# EAGLE design plyta_glowna0.1 (EAGLE 7.5.0)
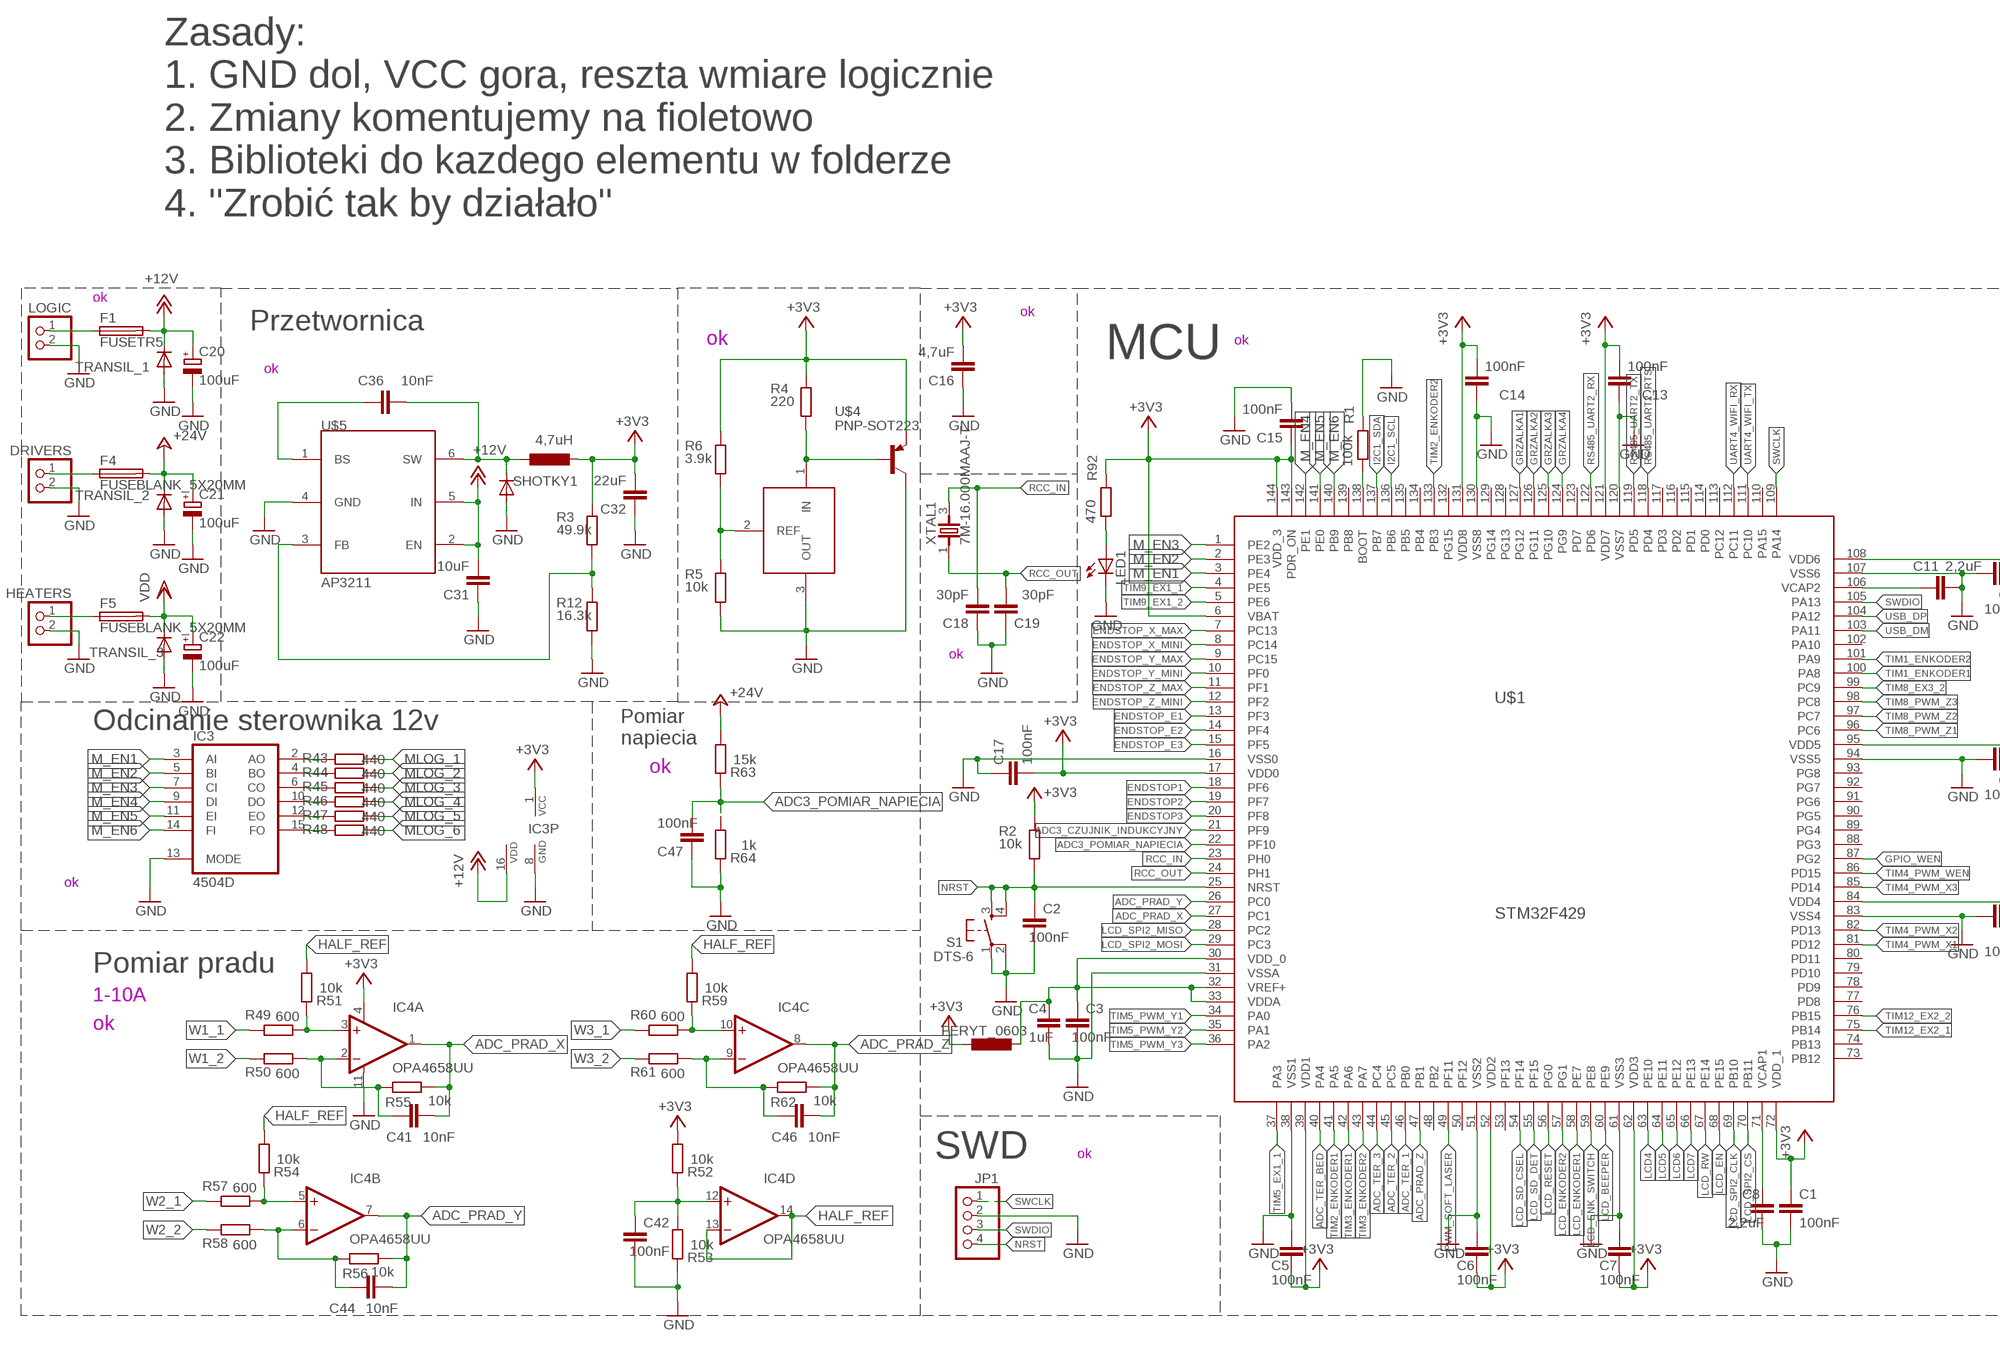
[diagram p0: schematic, sheet 1, part 1 of 2]
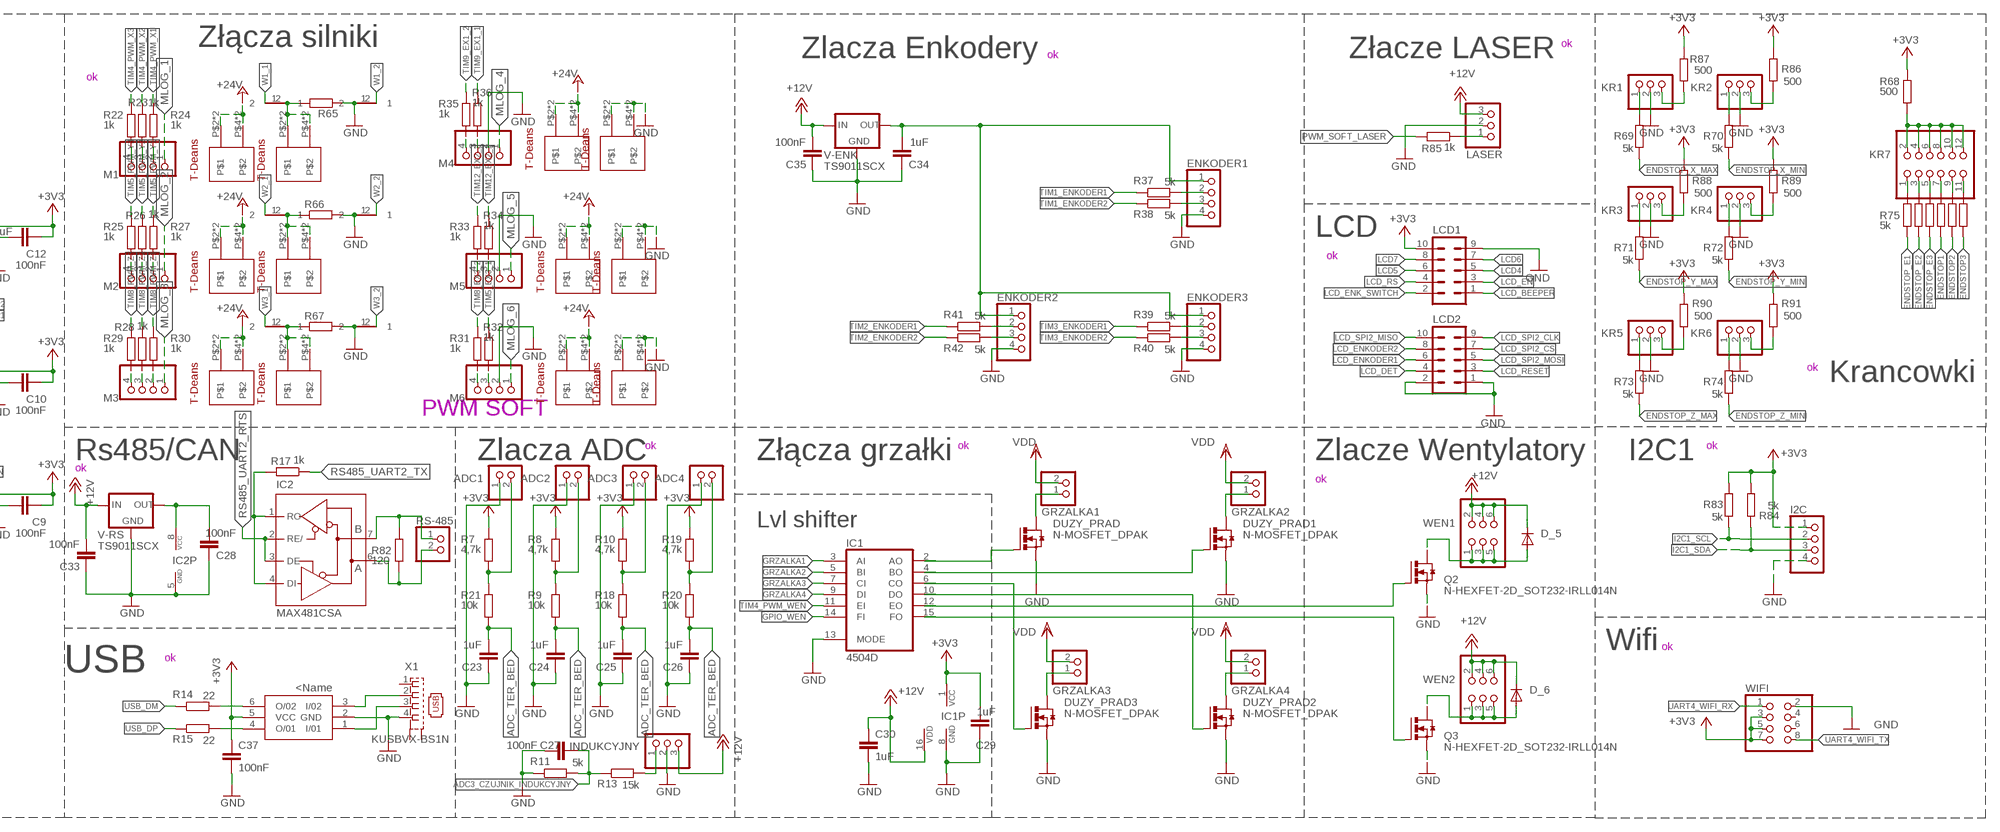
[diagram p1: schematic, sheet 1, part 2 of 2]

## Parts
1  PLYTKA_T  [PLYTKA_T]
2  PLYTKA_T  [PLYTKA_T]
3  PLYTKA_T  [PLYTKA_T]
4  PLYTKA_T  [PLYTKA_T]
4,7UH  FERYT_0603  [R0603]
5  PLYTKA_T  [PLYTKA_T]
6  PLYTKA_T  [PLYTKA_T]
7  PLYTKA_T  [PLYTKA_T]
8  PLYTKA_T  [PLYTKA_T]
9  PLYTKA_T  [PLYTKA_T]
10  PLYTKA_T  [PLYTKA_T]
11  PLYTKA_T  [PLYTKA_T]
12  PLYTKA_T  [PLYTKA_T]
ADC1  PINHD-1X2  [1X02]
ADC2  PINHD-1X2  [1X02]
ADC3  PINHD-1X2  [1X02]
ADC4  PINHD-1X2  [1X02]
C1  100nF  C-EUC0603  [C0603]
C2  100nF  C-EUC0603  [C0603]
C3  100nF  C-EUC0603  [C0603]
C4  1uF  C-EUC0603  [C0603]
C5  100nF  C-EUC0603  [C0603]
C6  100nF  C-EUC0603  [C0603]
C7  100nF  C-EUC0603  [C0603]
C8  2,2uF  C-EUC0603  [C0603]
C9  100nF  C-EUC0603  [C0603]
C10  100nF  C-EUC0603  [C0603]
C11  2,2uF  C-EUC0603  [C0603]
C12  100nF  C-EUC0603  [C0603]
C13  100nF  C-EUC0603  [C0603]
C14  100nF  C-EUC0603  [C0603]
C15  100nF  C-EUC0603  [C0603]
C16  4,7uF  C-EUC0603  [C0603]
C17  100nF  C-EUC0603  [C0603]
C18  30pF  C-EUC0603  [C0603]
C19  30pF  C-EUC0603  [C0603]
C20  100uF  CPOL-EUUD-8X10  [UD-8X10_NICHICON]
C21  100uF  CPOL-EUUD-8X10  [UD-8X10_NICHICON]
C22  100uF  CPOL-EUUD-8X10  [UD-8X10_NICHICON]
C23  1uF  C-EUC0603  [C0603]
C24  1uF  C-EUC0603  [C0603]
C25  1uF  C-EUC0603  [C0603]
C26  1uF  C-EUC0603  [C0603]
C27  100nF  C-EUC0603  [C0603]
C28  100nF  C-EUC0603  [C0603]
C29  1uF  C-EUC0603  [C0603]
C30  1uF  C-EUC0603  [C0603]
C31  10uF  C-EUC0603  [C0603]
C32  22uF  C-EUC0603  [C0603]
C33  100nF  C-EUC0603  [C0603]
C34  1uF  C-EUC0603  [C0603]
C35  100nF  C-EUC0603  [C0603]
C36  10nF  C-EUC0603  [C0603]
C37  100nF  C-EUC0603  [C0603]
C41  10nF  C-EUC0603  [C0603]
C42  100nF  C-EUC0603  [C0603]
C44  10nF  C-EUC0603  [C0603]
C46  10nF  C-EUC0603  [C0603]
C47  100nF  C-EUC0603  [C0603]
D_5  DIODE-DO-214AC  [DO-214AC]
D_6  DIODE-DO-214AC  [DO-214AC]
DRIVERS  PINHD-1X2  [1X02]
DUZY_PRAD  N-MOSFET_DPAK  [D-PAK_TO252AA]
DUZY_PRAD1  N-MOSFET_DPAK  [D-PAK_TO252AA]
DUZY_PRAD2  N-MOSFET_DPAK  [D-PAK_TO252AA]
DUZY_PRAD3  N-MOSFET_DPAK  [D-PAK_TO252AA]
ENKODER1  PINHD-1X4  [1X04]
ENKODER2  PINHD-1X4  [1X04]
ENKODER3  PINHD-1X4  [1X04]
F1  FUSETR5  [TR5]
F4  FUSEBLANK_5X20MM  [FUSE_HOLDER_5X20MM]
F5  FUSEBLANK_5X20MM  [FUSE_HOLDER_5X20MM]
GRZALKA1  PINHD-1X2  [1X02]
GRZALKA2  PINHD-1X2  [1X02]
GRZALKA3  PINHD-1X2  [1X02]
GRZALKA4  PINHD-1X2  [1X02]
HEATERS  PINHD-1X2  [1X02]
I2C  PINHD-1X4  [1X04]
IC1  4504D  [SO16]
IC2  MAX481CSA  [SO08]
IC3  4504D  [SO16]
IC4  OPA4658UU  [SO14]
INDUKCYJNY  PINHD-1X3  [1X03]
JP1  PINHD-1X4  [1X04]
KR1  PINHD-1X3  [1X03]
KR2  PINHD-1X3  [1X03]
KR3  PINHD-1X3  [1X03]
KR4  PINHD-1X3  [1X03]
KR5  PINHD-1X3  [1X03]
KR6  PINHD-1X3  [1X03]
KR7  PINHD-2X6  [2X06]
LASER  PINHD-1X3  [1X03]
LCD1  ML10  [ML10]
LCD2  ML10  [ML10]
LED1  LEDSML0603  [SML0603]
LOGIC  PINHD-1X2  [1X02]
M1  PINHD-1X4  [1X04]
M2  PINHD-1X4  [1X04]
M3  PINHD-1X4  [1X04]
M4  PINHD-1X4  [1X04]
M5  PINHD-1X4  [1X04]
M6  PINHD-1X4  [1X04]
Q2  N-HEXFET-2D_SOT232-IRLL014N  [SOT223]
Q3  N-HEXFET-2D_SOT232-IRLL014N  [SOT223]
R1  100k  R-EU_R0603  [R0603]
R2  10k  R-EU_R0603  [R0603]
R3  49.9k  R-EU_R0603  [R0603]
R4  220  R-EU_R0603  [R0603]
R5  10k  R-EU_R0603  [R0603]
R6  3.9k  R-EU_R0603  [R0603]
R7  4,7k  R-EU_R0603  [R0603]
R8  4,7k  R-EU_R0603  [R0603]
R9  10k  R-EU_R0603  [R0603]
R10  4,7k  R-EU_R0603  [R0603]
R11  5k  R-EU_R0603  [R0603]
R12  16.3k  R-EU_R0603  [R0603]
R13  15k  R-EU_R0603  [R0603]
R14  22  R-EU_R0603  [R0603]
R15  22  R-EU_R0603  [R0603]
R17  1k  R-EU_R0603  [R0603]
R18  10k  R-EU_R0603  [R0603]
R19  4,7k  R-EU_R0603  [R0603]
R20  10k  R-EU_R0603  [R0603]
R21  10k  R-EU_R0603  [R0603]
R22  1k  R-EU_R0603  [R0603]
R23  1k  R-EU_R0603  [R0603]
R24  1k  R-EU_R0603  [R0603]
R25  1k  R-EU_R0603  [R0603]
R26  1k  R-EU_R0603  [R0603]
R27  1k  R-EU_R0603  [R0603]
R28  1k  R-EU_R0603  [R0603]
R29  1k  R-EU_R0603  [R0603]
R30  1k  R-EU_R0603  [R0603]
R31  1k  R-EU_R0603  [R0603]
R32  1k  R-EU_R0603  [R0603]
R33  1k  R-EU_R0603  [R0603]
R34  1k  R-EU_R0603  [R0603]
R35  1k  R-EU_R0603  [R0603]
R36  1k  R-EU_R0603  [R0603]
R37  5k  R-EU_R0603  [R0603]
R38  5k  R-EU_R0603  [R0603]
R39  5k  R-EU_R0603  [R0603]
R40  5k  R-EU_R0603  [R0603]
R41  5k  R-EU_R0603  [R0603]
R42  5k  R-EU_R0603  [R0603]
R43  440  R-EU_R0603  [R0603]
R44  440  R-EU_R0603  [R0603]
R45  440  R-EU_R0603  [R0603]
R46  440  R-EU_R0603  [R0603]
R47  440  R-EU_R0603  [R0603]
R48  440  R-EU_R0603  [R0603]
R49  600  R-EU_R0603  [R0603]
R50  600  R-EU_R0603  [R0603]
R51  10k  R-EU_R0603  [R0603]
R52  10k  R-EU_R0603  [R0603]
R53  10k  R-EU_R0603  [R0603]
R54  10k  R-EU_R0603  [R0603]
R55  10k  R-EU_R0603  [R0603]
R56  10k  R-EU_R0603  [R0603]
R57  600  R-EU_R0603  [R0603]
R58  600  R-EU_R0603  [R0603]
R59  10k  R-EU_R0603  [R0603]
R60  600  R-EU_R0603  [R0603]
R61  600  R-EU_R0603  [R0603]
R62  10k  R-EU_R0603  [R0603]
R63  15k  R-EU_R0603  [R0603]
R64  1k  R-EU_R0603  [R0603]
R65  R-EU_R2512  [R2512]
R66  R-EU_R2512  [R2512]
R67  R-EU_R2512  [R2512]
R68  500  R-EU_R0603  [R0603]
R69  5k  R-EU_R0603  [R0603]
R70  5k  R-EU_R0603  [R0603]
R71  5k  R-EU_R0603  [R0603]
R72  5k  R-EU_R0603  [R0603]
R73  5k  R-EU_R0603  [R0603]
R74  5k  R-EU_R0603  [R0603]
R75  5k  R-EU_R0603  [R0603]
R76  5k  R-EU_R0603  [R0603]
R77  5k  R-EU_R0603  [R0603]
R78  5k  R-EU_R0603  [R0603]
R79  5k  R-EU_R0603  [R0603]
R80  5k  R-EU_R0603  [R0603]
R82  120  R-EU_R0603  [R0603]
R83  5k  R-EU_R0603  [R0603]
R84  5k  R-EU_R0603  [R0603]
R85  1k  R-EU_R0603  [R0603]
R86  500  R-EU_R0603  [R0603]
R87  500  R-EU_R0603  [R0603]
R88  500  R-EU_R0603  [R0603]
R89  500  R-EU_R0603  [R0603]
R90  500  R-EU_R0603  [R0603]
R91  500  R-EU_R0603  [R0603]
R92  470  R-EU_R0603  [R0603]
RS-485  PINHD-1X2  [1X02]
S1  DTS-6  [DTS-6]
SHOTKY1  DIODE-DO-214AC  [DO-214AC]
TRANSIL_1  DIODE-DO-214AC  [DO-214AC]
TRANSIL_2  DIODE-DO-214AC  [DO-214AC]
TRANSIL_3  DIODE-DO-214AC  [DO-214AC]
U$1  STM32F429  [SQFP-S-20X20-144]
U$2  FERYT_0603  [R0603]
U$3  TL431AIDBZR  [SOT23]
U$4  PNP-SOT223  [SOT223]
U$5  AP3211  [TSOT23]
U$6  USBLC6-2  [SOT95P275X110-6N]
U$20  SEPARATOR  [SEPARATOR]
U$21  SEPARATOR  [SEPARATOR]
U$22  SEPARATOR  [SEPARATOR]
U$23  SEPARATOR  [SEPARATOR]
U$24  SEPARATOR  [SEPARATOR]
U$25  SEPARATOR  [SEPARATOR]
V-ENK  TS9011SCX  [SOT23]
V-RS  TS9011SCX  [SOT23]
WEN1  PINHD-2X3  [2X03]
WEN2  PINHD-2X3  [2X03]
WIFI  PINHD-2X4  [2X04]
X1  KUSBVX-BS1N  [KUSBVX-BS1N]
XTAL1  7M-16.000MAAJ-T  [TXC_7M-16.000MAAJ-T]

## Nets
+3V3: 4,7UH.2 C1.1 C5.2 C6.2 C7.2 C9.2 C10.2 C12.2 C13.2 C14.2 C15.1 C16.2 C17.2 C29.2 C32.2 C37.1 I2C.1 IC1.1(VCC) IC3.1(VCC) IC4.4(A:V+) LCD1.10 R2.1 R3.1 R4.1 R6.1 R7.1 R8.1 R10.1 R19.1 R52.2 R68.2 R83.2 R84.2 R86.1 R87.1 R88.1 R89.1 R90.1 R91.1 R92.1 U$1.6(VBAT) U$1.17(VDD0) U$1.39(VDD1) U$1.52(VDD2) U$1.62(VDD3) U$1.72(VDD_1) U$1.84(VDD4) U$1.95(VDD5) U$1.108(VDD6) U$1.121(VDD7) U$1.131(VDD8) U$1.143(PDR_ON) U$1.144(VDD_3) U$2.1 U$4.3(E) U$6.5(VCC) WIFI.3 WIFI.5 WIFI.7
+12V: C20.+ C30.1 C31.2 C33.2 C35.2 D_5.C D_6.C F1.2 IC1.16(VDD) IC3.16(VDD) INDUKCYJNY.3 LASER.3 TRANSIL_1.C U$5.2(EN) U$5.5(IN) V-ENK.3(IN) V-RS.3(IN) WEN1.2 WEN1.4 WEN1.6 WEN2.2 WEN2.4 WEN2.6
+24V: 1.P$2 1.P$3 1.P$4 1.P$5 3.P$2 3.P$3 3.P$4 3.P$5 5.P$2 5.P$3 5.P$4 5.P$5 7.P$2 7.P$3 7.P$4 7.P$5 9.P$2 9.P$3 9.P$4 9.P$5 11.P$2 11.P$3 11.P$4 11.P$5 C21.+ F4.2 R63.2 TRANSIL_2.C
ADC3_CZUJNIK_INDUKCYJNY: U$1.21(PF9)
ADC3_POMIAR_NAPIECIA: C47.2 R63.1 R64.2 U$1.22(PF10)
ADC_PRAD_X: C41.2 IC4.1(A:OUT) R55.1 U$1.27(PC1)
ADC_PRAD_Y: C44.2 IC4.7(B:OUT) R56.1 U$1.26(PC0)
ADC_PRAD_Z: C46.2 IC4.8(C:OUT) R62.1 U$1.47(PB1)
ADC_TER_1: U$1.46(PB0)
ADC_TER_2: U$1.45(PC5)
ADC_TER_3: U$1.44(PC4)
ADC_TER_BED: C23.2 C24.2 C25.2 C26.2 R9.2 R18.2 R20.2 R21.2 U$1.40(PA4)
ENDSTOP1: R78.2 U$1.18(PF6)
ENDSTOP2: R79.2 U$1.19(PF7)
ENDSTOP3: R80.2 U$1.20(PF8)
ENDSTOP_E1: R75.2 U$1.13(PF3)
ENDSTOP_E2: R76.2 U$1.14(PF4)
ENDSTOP_E3: R77.2 U$1.15(PF5)
ENDSTOP_X_MAX: R69.1 U$1.7(PC13)
ENDSTOP_X_MINI: R70.1 U$1.8(PC14)
ENDSTOP_Y_MAX: R71.1 U$1.9(PC15)
ENDSTOP_Y_MINI: R72.1 U$1.10(PF0)
ENDSTOP_Z_MAX: R73.1 U$1.11(PF1)
ENDSTOP_Z_MINI: R74.1 U$1.12(PF2)
GND: 8.P$2 8.P$3 8.P$4 8.P$5 10.P$2 10.P$3 10.P$4 10.P$5 12.P$2 12.P$3 12.P$4 12.P$5 ADC1.1 ADC2.1 ADC3.1 ADC4.1 C1.2 C2.2 C3.2 C4.2 C5.1 C6.1 C7.1 C8.2 C9.1 C10.1 C11.2 C12.1 C13.1 C14.1 C15.2 C16.1 C17.1 C18.1 C19.1 C20.- C21.- C22.- C23.1 C24.1 C25.1 C26.1 C27.2 C28.1 C29.1 C30.2 C31.1 C32.1 C33.1 C34.1 C35.1 C37.2 C42.2 C47.1 DRIVERS.2 DUZY_PRAD1.3(S) DUZY_PRAD2.3(S) DUZY_PRAD3.3(S) DUZY_PRAD.3(S) ENKODER1.4 ENKODER2.4 ENKODER3.4 HEATERS.2 I2C.4 IC1.8(GND) IC1.13(MODE) IC2.5(GND) IC3.8(GND) IC3.13(MODE) IC4.11(A:V-) INDUKCYJNY.2 JP1.2 KR1.2 KR2.2 KR3.2 KR4.2 KR5.2 KR6.2 LASER.2 LCD1.9 LCD2.1 LCD2.2 LED1.C LOGIC.2 M4.2 M5.2 M6.2 Q2.3(S) Q3.3(S) R1.1 R5.2 R11.1 R12.2 R53.1 R64.1 R65.1 R66.2 R67.2 S1.1 S1.2 SHOTKY1.A TRANSIL_1.A TRANSIL_2.A TRANSIL_3.A U$1.16(VSS0) U$1.31(VSSA) U$1.38(VSS1) U$1.51(VSS2) U$1.61(VSS3) U$1.83(VSS4) U$1.94(VSS5) U$1.107(VSS6) U$1.120(VSS7) U$1.130(VSS8) U$3.3(OUT) U$4.2(C) U$4.4(C) U$5.4(GND) U$6.2(GND) U$20.1 U$21.1 U$22.1 V-ENK.1(GND) V-RS.1(GND) WIFI.2 X1.4
GPIO_WEN: IC1.14(FI) U$1.87(PG2)
GRZALKA1: IC1.3(AI) U$1.127(PG12)
GRZALKA2: IC1.5(BI) U$1.126(PG11)
GRZALKA3: IC1.7(CI) U$1.125(PG10)
GRZALKA4: IC1.9(DI) U$1.124(PG9)
HALF_REF: IC4.13(D:-IN) IC4.14(D:OUT) R51.2 R54.2 R59.2
I2C1_SCL: I2C.2 R83.1 U$1.136(PB6)
I2C1_SDA: I2C.3 R84.1 U$1.137(PB7)
LCD4: LCD1.5 U$1.63(PE10)
LCD5: LCD1.6 U$1.64(PE11)
LCD6: LCD1.7 U$1.65(PE12)
LCD7: LCD1.8 U$1.66(PE13)
LCD_BEEPER: LCD1.1 U$1.60(PE9)
LCD_DET: LCD2.4
LCD_EN: LCD1.3 U$1.68(PE15)
LCD_ENK_SWITCH: LCD1.2 U$1.59(PE8)
LCD_ENKODER1: LCD2.6 U$1.58(PE7)
LCD_ENKODER2: LCD2.8 U$1.57(PG1)
LCD_RESET: LCD2.3 U$1.56(PG0)
LCD_RS: LCD1.4
LCD_RW: U$1.67(PE14)
LCD_SD_CSEL: U$1.54(PF14)
LCD_SD_DET: U$1.55(PF15)
LCD_SPI2_CLK: LCD2.9 U$1.69(PB10)
LCD_SPI2_CS: LCD2.7 U$1.70(PB11)
LCD_SPI2_MISO: LCD2.10 U$1.28(PC2)
LCD_SPI2_MOSI: LCD2.5 U$1.29(PC3)
M_EN1: IC3.3(AI)
M_EN3: U$1.1(PE2)
MLOG_1: M1.1 R43.2
MLOG_2: M2.1 R44.2
MLOG_3: M3.1 R45.2
MLOG_4: M4.1 R46.2
MLOG_5: M5.1 R47.2
MLOG_6: M6.1 R48.2
N$1: 4,7UH.1 C36.1 SHOTKY1.C U$5.6(SW)
N$2: C8.1 U$1.71(VCAP1)
N$3: R3.2 R12.1 U$5.3(FB)
N$4: R14.2 U$6.6(O/02)
N$5: C3.1 C4.1 U$1.30(VDD_0) U$1.32(VREF+) U$1.33(VDDA) U$2.2
N$6: R5.1 R6.2 U$3.2(REF)
N$7: F1.1 LOGIC.1
N$8: DRIVERS.1 F4.1
N$9: R4.2 U$3.1(IN) U$4.1(B)
N$10: F5.1 HEATERS.1
N$11: D_6.A Q3.2(D) Q3.4(D) WEN2.1 WEN2.3 WEN2.5
N$12: DUZY_PRAD.4(D) GRZALKA1.1
N$13: R15.2 U$6.4(O/01)
N$15: D_5.A Q2.2(D) Q2.4(D) WEN1.1 WEN1.3 WEN1.5
N$16: U$6.1(I/01) X1.3
N$17: DUZY_PRAD1.4(D) GRZALKA2.1
N$18: DUZY_PRAD2.4(D) GRZALKA4.1
N$19: C11.1 U$1.106(VCAP2)
N$20: DUZY_PRAD3.4(D) GRZALKA3.1
N$21: DUZY_PRAD.1(G) IC1.2(AO)
N$22: KR1.1 R69.2
N$23: LASER.1 R85.1
N$24: KR3.1 R71.2
N$25: KR2.1 R70.2
N$26: R1.2 U$1.138(BOOT)
N$27: KR4.1 R72.2
N$28: KR6.1 R74.2
N$29: KR5.1 R73.2
N$30: IC2.7(B) R82.1 RS-485.1
N$31: IC2.6(A) R82.2 RS-485.2
N$32: KR7.1 R75.1
N$33: DUZY_PRAD1.1(G) IC1.4(BO)
N$34: DUZY_PRAD3.1(G) IC1.6(CO)
N$35: DUZY_PRAD2.1(G) IC1.10(DO)
N$36: IC1.12(EO) Q2.1(G)
N$37: IC1.15(FO) Q3.1(G)
N$38: INDUKCYJNY.1 R13.2
N$39: C36.2 U$5.1(BS)
N$40: C28.2 IC2.8(VCC) V-RS.2(OUT)
N$41: M1.4 R22.2
N$42: ADC2.2 R8.2 R9.1
N$43: ADC1.2 R7.2 R21.1
N$44: ADC3.2 R10.2 R18.1
N$45: M1.3 R23.2
N$46: M1.2 R24.2
N$47: ADC4.2 R19.2 R20.1
N$48: M6.4 R31.2
N$49: M2.4 R25.2
N$50: M2.3 R26.2
N$51: M6.3 R32.2
N$52: M3.4 R29.2
N$53: M3.3 R28.2
N$54: U$6.3(I/02) X1.2
N$55: M5.4 R33.2
N$56: M5.3 R34.2
N$57: M2.2 R27.2
N$58: M4.4 R35.2
N$59: M4.3 R36.2
N$60: ENKODER1.2 R37.2
N$61: ENKODER1.3 R38.2
N$62: ENKODER3.2 R39.2
N$63: ENKODER3.3 R40.2
N$64: ENKODER2.2 R41.2
N$65: ENKODER2.3 R42.2
N$67: IC3.2(AO) R43.1
N$68: IC3.4(BO) R44.1
N$69: IC3.6(CO) R45.1
N$70: IC3.10(DO) R46.1
N$71: IC3.12(EO) R47.1
N$72: IC3.15(FO) R48.1
N$73: IC4.3(A:+IN) R49.2 R51.1
N$74: C42.1 IC4.12(D:+IN) R52.1 R53.2
N$75: C41.1 IC4.2(A:-IN) R50.2 R55.2
N$76: C46.1 IC4.9(C:-IN) R61.2 R62.2
N$77: 2.P$2 2.P$3 2.P$4 2.P$5 R65.2 U$23.2
N$78: 4.P$2 4.P$3 4.P$4 4.P$5 R66.1 U$24.2
N$79: IC4.10(C:+IN) R59.1 R60.2
N$80: C44.1 IC4.6(B:-IN) R56.2 R58.2
N$81: IC4.5(B:+IN) R54.1 R57.2
N$83: 6.P$2 6.P$3 6.P$4 6.P$5 R67.1 U$25.2
N$84: KR7.3 R76.1
N$85: KR7.5 R77.1
N$86: KR7.7 R78.1
N$87: KR7.9 R79.1
N$88: KR7.11 R80.1
N$89: KR7.2 KR7.4 KR7.6 KR7.8 KR7.10 KR7.12 R68.1
N$90: KR1.3 R87.2
N$91: KR2.3 R86.2
N$92: KR3.3 R88.2
N$93: KR4.3 R89.2
N$94: KR5.3 R90.2
N$95: KR6.3 R91.2
N$96: C27.1 R11.2 R13.1
N$97: LED1.A R92.2
N$99: C34.2 ENKODER1.1 ENKODER2.1 ENKODER3.1 V-ENK.2(OUT)
NRST: C2.1 JP1.4 R2.2 S1.3 S1.4 U$1.25(NRST)
PWM_SOFT_LASER: R85.2 U$1.49(PF11)
RCC_IN: C18.2 U$1.23(PH0) XTAL1.3
RCC_OUT: C19.2 U$1.24(PH1) XTAL1.1
RS485_UART2_RTS: IC2.2(RE/) IC2.3(DE) U$1.118(PD4)
RS485_UART2_RX: U$1.122(PD6)
RS485_UART2_TX: IC2.1(RO) IC2.4(DI) R17.1 R17.2 U$1.119(PD5)
SWCLK: JP1.1 U$1.109(PA14)
SWDIO: JP1.3 U$1.105(PA13)
TIM1_ENKODER1: R37.1 U$1.100(PA8)
TIM1_ENKODER2: R38.1 U$1.101(PA9)
TIM2_ENKODER1: R41.1 U$1.41(PA5)
TIM2_ENKODER2: R42.1 U$1.133(PB3)
TIM3_ENKODER1: R39.1 U$1.42(PA6)
TIM3_ENKODER2: R40.1 U$1.43(PA7)
TIM4_PWM_WEN: IC1.11(EI) U$1.86(PD15)
TIM4_PWM_X1: R24.1 U$1.81(PD12)
TIM4_PWM_X2: R23.1 U$1.82(PD13)
TIM4_PWM_X3: R22.1 U$1.85(PD14)
TIM5_EX1_1: U$1.37(PA3)
TIM5_EX3_1: R32.1
TIM5_PWM_Y1: R27.1 U$1.34(PA0)
TIM5_PWM_Y2: R26.1 U$1.35(PA1)
TIM5_PWM_Y3: R25.1 U$1.36(PA2)
TIM8_EX3_2: R31.1 U$1.99(PC9)
TIM8_PWM_Z1: M3.2 R30.1 R30.2 U$1.96(PC6)
TIM8_PWM_Z2: R28.1 U$1.97(PC7)
TIM8_PWM_Z3: R29.1 U$1.98(PC8)
TIM9_EX1_1: R36.1 U$1.4(PE5)
TIM9_EX1_2: R35.1 U$1.5(PE6)
TIM12_EX2_1: R34.1 U$1.75(PB14)
TIM12_EX2_2: R33.1 U$1.76(PB15)
UART4_WIFI_RX: U$1.112(PC11) WIFI.1
UART4_WIFI_TX: U$1.111(PC10) WIFI.8
USB_DM: R14.1 U$1.103(PA11)
USB_DP: R15.1 U$1.104(PA12)
VDD: C22.+ F5.2 GRZALKA1.2 GRZALKA2.2 GRZALKA3.2 GRZALKA4.2 TRANSIL_3.C
W1_1: R49.1 U$23.1
W1_2: R50.1 U$20.2
W2_1: R57.1 U$24.1
W2_2: R58.1 U$21.2
W3_1: R60.1 U$25.1
W3_2: R61.1 U$22.2
Unconnected: IC3.5(BI) IC3.7(CI) IC3.9(DI) IC3.11(EI) IC3.14(FI) U$1.2(PE3) U$1.3(PE4) U$1.48(PB2) U$1.50(PF12) U$1.53(PF13) U$1.73(PB12) U$1.74(PB13) U$1.77(PD8) U$1.78(PD9) U$1.79(PD10) U$1.80(PD11) U$1.88(PG3) U$1.89(PG4) U$1.90(PG5) U$1.91(PG6) U$1.92(PG7) U$1.93(PG8) U$1.102(PA10) U$1.110(PA15) U$1.113(PC12) U$1.114(PD0) U$1.115(PD1) U$1.116(PD2) U$1.117(PD3) U$1.123(PD7) U$1.128(PG13) U$1.129(PG14) U$1.132(PG15) U$1.134(PB4) U$1.135(PB5) U$1.139(PB8) U$1.140(PB9) U$1.141(PE0) U$1.142(PE1) WIFI.4 WIFI.6 X1.1 X1.M1(S1) X1.M2(S2)

## Notes on the sheet
- Zasady:
  1. GND dol, VCC gora, reszta wmiare logicznie
  2. Zmiany komentujemy na fioletowo
  3. Biblioteki do kazdego elementu w folderze
  4. "Zrobić tak by działało"
- ok
- ok
- Przetwornica | Złącza silniki | ok
- ok | ok | Zlacza Enkodery | ok | Złacze LASER
- MCU
- ok | ok
- 4,7uH
- LCD
- ok
- ok
- Odcinanie sterownika 12v
- Pomiar
  napiecia
- ok
- Krancowki
- ok
- PWM SOFT
- ok | ok | ok
- Rs485/CAN | Zlacza ADC | Złącza grzałki | Zlacze Wentylatory | I2C1
- ok
- ok | ok
- Lvl shifter
- Pomiar pradu
- 1-10A
- ok
- Wifi | ok
- ok
- USB
- SWD | ok

## Library data of the parts
1-12 = Conector_T-deans:PLYTKA_T
4,7UH U$2 = rcl:FERYT_0603
ADC1-ADC4 DRIVERS GRZALKA1-GRZALKA4 HEATERS LOGIC RS-485 = pinhead:PINHD-1X2: PIN HEADER
C1-C19 C23-C37 C41 C42 C44 C46 C47 = rcl:C-EU: CAPACITOR, European symbol
C20-C22 = rcl:CPOL-EU: POLARIZED CAPACITOR, European symbol
D_5 D_6 SHOTKY1 TRANSIL_1-TRANSIL_3 = diode:DIODE-: DIODE
DUZY_PRAD DUZY_PRAD1-DUZY_PRAD3 = transistor-power:N-MOSFET_DPAK
ENKODER1-ENKODER3 I2C JP1 M1-M6 = pinhead:PINHD-1X4: PIN HEADER
F1 F4 F5 = fuse:FUSE: Fuse; OC_FARNELL: unknown; OC_NEWARK: unknown
IC1 IC3 = 45xx:4504: TTL or CMOS to CMOS hex LEVEL SHIFTER
IC2 = maxim:MAX481CSA: RS485 TRANSEIVER; MF: MAXIM; MPN: MAX481CSA; OC_FARNELL: unknown; OC_NEWARK: 90C3817
IC4 = burr-brown:OPA4658U: Operational Amplifier; OC_FARNELL: unknown; OC_NEWARK: unknown
INDUKCYJNY KR1-KR6 LASER = pinhead:PINHD-1X3: PIN HEADER
KR7 = pinhead:PINHD-2X6: PIN HEADER
LCD1 LCD2 = con-harting-ml:ML10: HARTING; OC_FARNELL: unknown; OC_NEWARK: unknown
LED1 = led:LED: LED OSRAM: - CHIPLED LG R971, LG N971, LY N971, LG Q971, LY Q971, LO R971, LY R971 LH N974, LH R974 LS Q976, LO Q976, LY Q976 LO Q996 - Hyper CHIPLED LW Q18S LB Q993, LB Q99A, LB R99A - SideLED LS A670, LO A670, LY A670, LG A670, LP A670 LB A673, LV A673, LT A673, LW A673 LH A674 LY A675 LS A676, LA A676, LO A676, LY A676, LW A676 LS A679, LY A679, LG A679 - Hyper Micro SIDELED® LS Y876, LA Y876, LO Y876, LY Y876 LT Y87S - SmartLED LW L88C, LW L88S LB L89C, LB L89S, LG L890 LS L89K, LO L89K, LY L89K LS L896, LA L896, LO L896, LY L896 - TOPLED LS T670, LO T670, LY T670, LG T670, LP T670 LSG T670, LSP T670, LSY T670, LOP T670, LYG T670 LG T671, LOG T671, LSG T671 LB T673, LV T673, LT T673, LW T673 LH T674 LS T676, LA T676, LO T676, LY T676, LB T676, LH T676, LSB T676, LW T676 LB T67C, LV T67C, LT T67C, LS T67K, LO T67K, LY T67K, LW E67C LS E67B, LA E67B, LO E67B, LY E67B, LB E67C, LV E67C, LT E67C LW T67C LS T679, LY T679, LG T679 LS T770, LO T770, LY T770, LG T770, LP T770 LB T773, LV T773, LT T773, LW T773 LH T774 LS E675, LA E675, LY E675, LS T675 LS T776, LA T776, LO T776, LY T776, LB T776 LHGB T686 LT T68C, LB T68C - Hyper Mini TOPLED® LB M676 - Mini TOPLED Santana® LG M470 LS M47K, LO M47K, LY M47K Source: http://www.osram.convergy.de LUXEON: - LUMILED® LXK2-PW12-R00, LXK2-PW12-S00, LXK2-PW14-U00, LXK2-PW14-V00 LXK2-PM12-R00, LXK2-PM12-S00, LXK2-PM14-U00 LXK2-PE12-Q00, LXK2-PE12-R00, LXK2-PE12-S00, LXK2-PE14-T00, LXK2-PE14-U00 LXK2-PB12-K00, LXK2-PB12-L00, LXK2-PB12-M00, LXK2-PB14-N00, LXK2-PB14-P00, LXK2-PB14-Q00 LXK2-PR12-L00, LXK2-PR12-M00, LXK2-PR14-Q00, LXK2-PR14-R00 LXK2-PD12-Q00, LXK2-PD12-R00, LXK2-PD12-S00 LXK2-PH12-R00, LXK2-PH12-S00 LXK2-PL12-P00, LXK2-PL12-Q00, LXK2-PL12-R00 Source: www.luxeon.com KINGBRIGHT: KA-3528ASYC Source: www.kingbright.com
Q2 Q3 = transistor-power:N-HEXFET-2D_?-*: HEXFET® Power MOSFET 2 Drain connects http://www.irf.com/product-info/datasheets/data/irll014n.pdf
R1-R15 R17-R80 R82-R92 = rcl:R-EU_: RESISTOR, European symbol
S1 = switch-tact:DTS-6
U$1 = Stm32_144pin:STM32F429
U$3 = robione:TL431AIDBZR
U$4 = robione:PNP
U$5 = Przetwornice:AP3211
U$6 = ESD_protection:USBLC6-2
U$20-U$25 = robione:SEPARATOR
V-ENK V-RS = v-reg:TS9011SCX
WEN1 WEN2 = pinhead:PINHD-2X3: PIN HEADER
WIFI = pinhead:PINHD-2X4: PIN HEADER
X1 = con-kycon:KUSBVX-BS1N: USB B-type Receptacle Vertical, 4 Position, Through Hole Source: Sibalco Kycon KUSBVX-BS1N-xxx.pdf
XTAL1 = TXC-7M-16.000MAAJ-T:7M-16.000MAAJ-T: CRYSTAL SEAM, 16MHZ, 18PF, SMD; MPN: 7M-16.000MAAJ-T; OC_FARNELL: 1842060; OC_NEWARK: 84R5710; PACKAGE: SMD; SUPPLIER: TXC

## Board
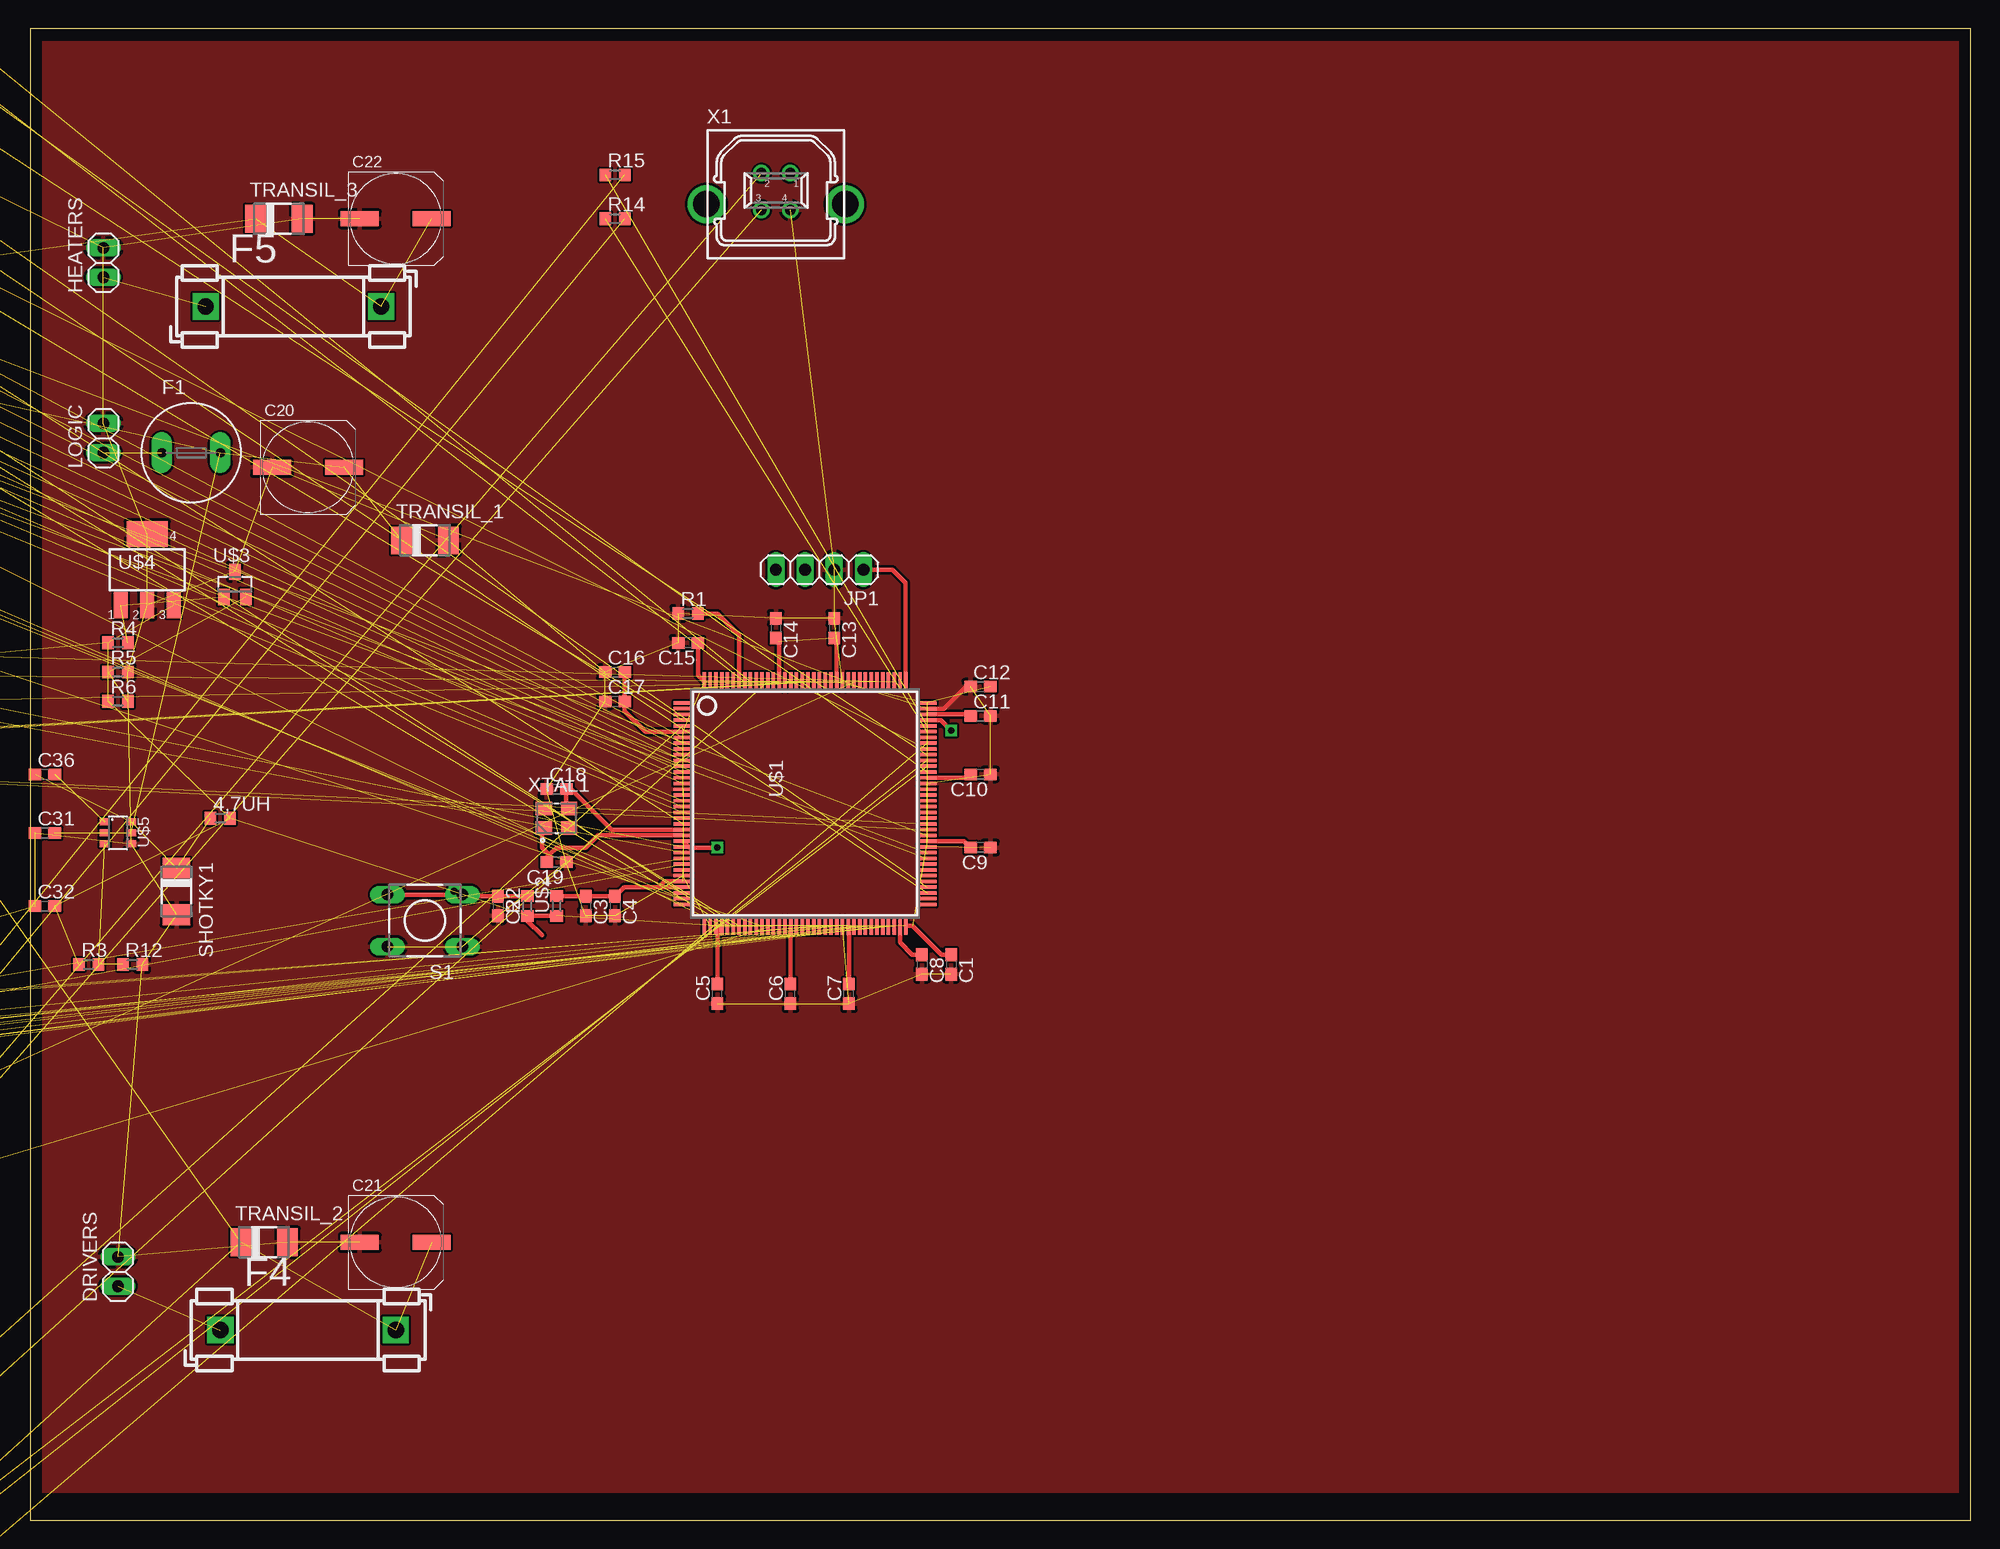
[diagram p2: board, top side]
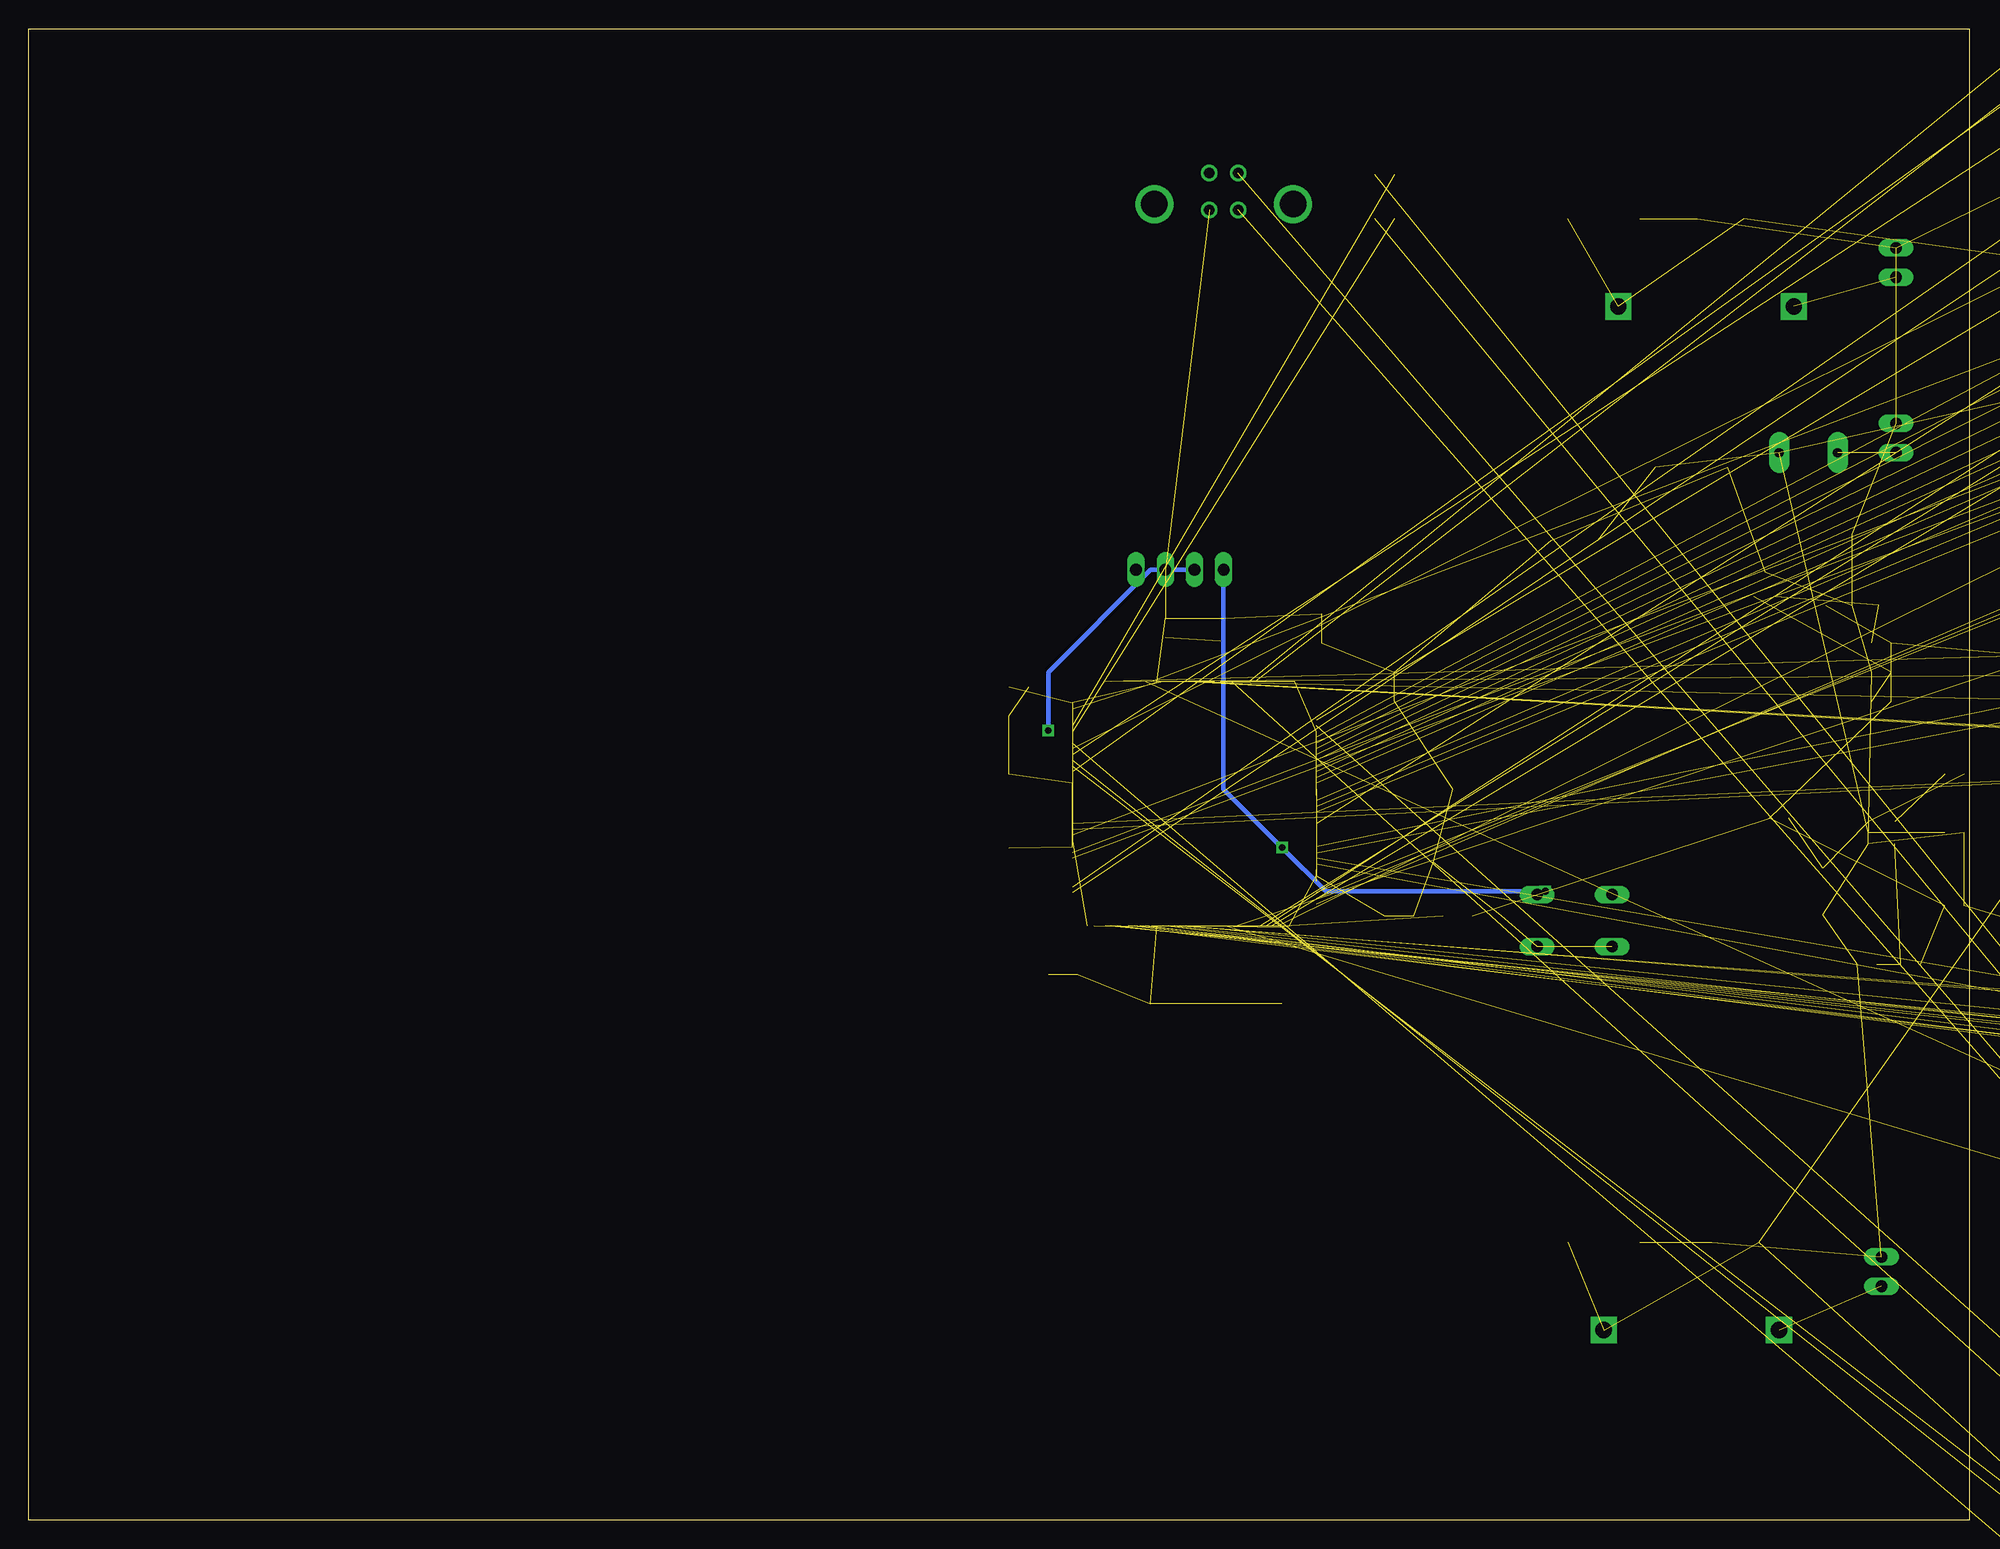
[diagram p3: board, bottom side, seen from below]

Size 168.58 x 129.53 mm. Coordinates in mm from the lower left corner, seen from the top.
Outline: 0,0 168.58,0 168.58,129.53 0,129.53 0,0
Copper layers (1*16): Top 0.035mm / dielectric 1.5mm / Bottom 0.035mm
Design rules "default": minimum track width 10mil, minimum drill 24mil, track to track 8mil, track to pad 8mil, pad to pad 8mil, via to via 8mil, smd to smd 8mil, copper to edge 40mil, drill to drill 8mil, minimum pad ring 10mil, minimum via ring 8mil, stop-mask expansion 4mil, vias tented up to drill 0mil, thermal gap 10mil

### Footprints (pad centres in the part's own frame; a part is rotated, then mirrored left to right if it is on the bottom)
PLYTKA_T = smd 5 x 2: P$2 0,2; P$3 0,5 | smd 2 x 5: P$4 -1.47,-3.51; P$5 1.5,-3.5
R0603 = smd 1 x 1.1: 1 -0.85,0; 2 0.85,0
1X02 = drill 1.016 long: 1 -1.27,0; 2 1.27,0
C0603 = smd 1.1 x 1: 1 -0.85,0; 2 0.85,0
UD-8X10_NICHICON = smd 3.3 x 1.3: + 3.125,0; - -3.125,0
DO-214AC = smd 1.8 x 2.4: A 2.025,0; C -2.025,0
D-PAK_TO252AA = smd 1 x 1.6: 1 -2.28,-4.8; 3 2.28,-4.8 | smd 5.4 x 6.2: 4 0,2.5
1X04 = drill 1.016 long: 1 -3.81,0; 2 -1.27,0; 3 1.27,0; 4 3.81,0
TR5 = drill 0.813 pad 1.778 long: 1 -2.54,0; 2 2.54,0
FUSE_HOLDER_5X20MM = drill 1.422 pad 2.286 square: 1 0,0; 2 15.24,0
SO16 = smd 0.66 x 2.032: 1 -4.445,-3.073; 2 -3.175,-3.073; 3 -1.905,-3.073; 4 -0.635,-3.073; 5 0.635,-3.073; 6 1.905,-3.073; 7 3.175,-3.073; 8 4.445,-3.073; 9 4.445,3.073; 10 3.175,3.073; 11 1.905,3.073; 12 0.635,3.073; 13 -0.635,3.073; 14 -1.905,3.073; 15 -3.175,3.073; 16 -4.445,3.073
SO08 = smd 0.66 x 2.032: 1 -1.905,-3.073; 2 -0.635,-3.073; 3 0.635,-3.073; 4 1.905,-3.073; 5 1.905,3.073; 6 0.635,3.073; 7 -0.635,3.073; 8 -1.905,3.073
SO14 = smd 0.61 x 2.21: 1 -3.81,-2.603; 2 -2.54,-2.603; 3 -1.27,-2.603; 4 0,-2.603; 5 1.27,-2.603; 6 2.54,-2.603; 7 3.81,-2.603; 8 3.81,2.603; 9 2.54,2.603; 10 1.27,2.603; 11 0,2.603; 12 -1.27,2.603; 13 -2.54,2.603; 14 -3.81,2.603
1X03 = drill 1.016 long: 1 -2.54,0; 2 0,0; 3 2.54,0
2X06 = drill 1.016 octagon: 1 -6.35,-1.27; 2 -6.35,1.27; 3 -3.81,-1.27; 4 -3.81,1.27; 5 -1.27,-1.27; 6 -1.27,1.27; 7 1.27,-1.27; 8 1.27,1.27; 9 3.81,-1.27; 10 3.81,1.27; 11 6.35,-1.27; 12 6.35,1.27
ML10 = drill 0.914 octagon: 1 -5.08,-1.27; 2 -5.08,1.27; 3 -2.54,-1.27; 4 -2.54,1.27; 5 0,-1.27; 6 0,1.27; 7 2.54,-1.27; 8 2.54,1.27; 9 5.08,-1.27; 10 5.08,1.27
SML0603 = smd 0.8 x 0.8: A 0.75,0; C -0.75,0
SOT223 = smd 1.219 x 2.235: 1 -2.311,-3.099; 2 0,-3.099; 3 2.311,-3.099 | smd 3.6 x 2.2: 4 0,3.099
R2512 = smd 1.8 x 3.2: 1 -2.8,0; 2 2.8,0
DTS-6 = drill 1 long: 1 -3.25,2.25; 2 3.25,2.25; 3 -3.25,-2.25; 4 3.25,-2.25
SQFP-S-20X20-144 = smd 0.3 x 1.6: 1 -8.75,-10.6; 2 -8.25,-10.6; 3 -7.75,-10.6; 4 -7.25,-10.6; 5 -6.75,-10.6; 6 -6.25,-10.6; 7 -5.75,-10.6; 8 -5.25,-10.6; 9 -4.75,-10.6; 10 -4.25,-10.6; 11 -3.75,-10.6; 12 -3.25,-10.6; 13 -2.75,-10.6; 14 -2.25,-10.6; 15 -1.75,-10.6; 16 -1.25,-10.6; 17 -0.75,-10.6; 18 -0.25,-10.6; 19 0.25,-10.6; 20 0.75,-10.6; 21 1.25,-10.6; 22 1.75,-10.6; 23 2.25,-10.6; 24 2.75,-10.6; 25 3.25,-10.6; 26 3.75,-10.6; 27 4.25,-10.6; 28 4.75,-10.6; 29 5.25,-10.6; 30 5.75,-10.6; 31 6.25,-10.6; 32 6.75,-10.6; 33 7.25,-10.6; 34 7.75,-10.6; 35 8.25,-10.6; 36 8.75,-10.6; 73 8.75,10.6; 74 8.25,10.6; 75 7.75,10.6; 76 7.25,10.6; 77 6.75,10.6; 78 6.25,10.6; 79 5.75,10.6; 80 5.25,10.6; 81 4.75,10.6; 82 4.25,10.6; 83 3.75,10.6; 84 3.25,10.6; 85 2.75,10.6; 86 2.25,10.6; 87 1.75,10.6; 88 1.25,10.6; 89 0.75,10.6; 90 0.25,10.6; 91 -0.25,10.6; 92 -0.75,10.6; 93 -1.25,10.6; 94 -1.75,10.6; 95 -2.25,10.6; 96 -2.75,10.6; 97 -3.25,10.6; 98 -3.75,10.6; 99 -4.25,10.6; 100 -4.75,10.6; 101 -5.25,10.6; 102 -5.75,10.6; 103 -6.25,10.6; 104 -6.75,10.6; 105 -7.25,10.6; 106 -7.75,10.6; 107 -8.25,10.6; 108 -8.75,10.6 | smd 1.6 x 0.3: 37 10.6,-8.75; 38 10.6,-8.25; 39 10.6,-7.75; 40 10.6,-7.25; 41 10.6,-6.75; 42 10.6,-6.25; 43 10.6,-5.75; 44 10.6,-5.25; 45 10.6,-4.75; 46 10.6,-4.25; 47 10.6,-3.75; 48 10.6,-3.25; 49 10.6,-2.75; 50 10.6,-2.25; 51 10.6,-1.75; 52 10.6,-1.25; 53 10.6,-0.75; 54 10.6,-0.25; 55 10.6,0.25; 56 10.6,0.75; 57 10.6,1.25; 58 10.6,1.75; 59 10.6,2.25; 60 10.6,2.75; 61 10.6,3.25; 62 10.6,3.75; 63 10.6,4.25; 64 10.6,4.75; 65 10.6,5.25; 66 10.6,5.75; 67 10.6,6.25; 68 10.6,6.75; 69 10.6,7.25; 70 10.6,7.75; 71 10.6,8.25; 72 10.6,8.75; 109 -10.6,8.75; 110 -10.6,8.25; 111 -10.6,7.75; 112 -10.6,7.25; 113 -10.6,6.75; 114 -10.6,6.25; 115 -10.6,5.75; 116 -10.6,5.25; 117 -10.6,4.75; 118 -10.6,4.25; 119 -10.6,3.75; 120 -10.6,3.25; 121 -10.6,2.75; 122 -10.6,2.25; 123 -10.6,1.75; 124 -10.6,1.25; 125 -10.6,0.75; 126 -10.6,0.25; 127 -10.6,-0.25; 128 -10.6,-0.75; 129 -10.6,-1.25; 130 -10.6,-1.75; 131 -10.6,-2.25; 132 -10.6,-2.75; 133 -10.6,-3.25; 134 -10.6,-3.75; 135 -10.6,-4.25; 136 -10.6,-4.75; 137 -10.6,-5.25; 138 -10.6,-5.75; 139 -10.6,-6.25; 140 -10.6,-6.75; 141 -10.6,-7.25; 142 -10.6,-7.75; 143 -10.6,-8.25; 144 -10.6,-8.75
SOT23 = smd 1 x 1.4: 1 -0.95,-1.1; 2 0.95,-1.1; 3 0,1.1
TSOT23 = smd 0.6 x 0.9: 1 -0.95,-1.15; 2 0,-1.15; 3 0.95,-1.15; 4 0.95,1.15; 5 0,1.15; 6 -0.95,1.15
SOT95P275X110-6N = smd 1.321 x 0.559: 1 -1.27,0.94; 2 -1.27,0; 3 -1.27,-0.94; 4 1.27,-0.94; 5 1.27,0; 6 1.27,0.94
SEPARATOR = smd 0.5 x 0.3: 1 -0.25,0; 2 0.25,0
2X03 = drill 1.016 octagon: 1 -2.54,-1.27; 2 -2.54,1.27; 3 0,-1.27; 4 0,1.27; 5 2.54,-1.27; 6 2.54,1.27
2X04 = drill 1.016 octagon: 1 -3.81,-1.27; 2 -3.81,1.27; 3 -1.27,-1.27; 4 -1.27,1.27; 5 1.27,-1.27; 6 1.27,1.27; 7 3.81,-1.27; 8 3.81,1.27
KUSBVX-BS1N = drill 0.9 pad 1.422: 1 1.25,2.7; 2 -1.25,2.7; 3 -1.25,-0.5; 4 1.25,-0.5 | drill 2.3 pad 2.7: M1 -6.02,0; M2 6.02,0
TXC_7M-16.000MAAJ-T = smd 1.4 x 1.2: 1 -1.1,-0.85; 2 1.1,-0.85; 3 1.1,0.85; 4 -1.1,0.85

### Placement (x,y rotation side)
1  -187.96,-167.64 0 top  (outside the outline)
2  -198.12,-167.64 0 top  (outside the outline)
3  -208.28,-167.64 0 top  (outside the outline)
4  -218.44,-167.64 0 top  (outside the outline)
4,7UH  16.51,60.96 0 top
5  -228.6,-167.64 0 top  (outside the outline)
6  -238.76,-167.64 0 top  (outside the outline)
7  -248.92,-167.64 0 top  (outside the outline)
8  -259.08,-167.64 0 top  (outside the outline)
9  -269.24,-167.64 0 top  (outside the outline)
10  -279.4,-167.64 0 top  (outside the outline)
11  -289.56,-167.64 0 top  (outside the outline)
12  -299.72,-167.64 0 top  (outside the outline)
ADC1  -114.3,104.14 0 top  (outside the outline)
ADC2  -165.1,-44.45 0 top  (outside the outline)
ADC3  -165.1,-60.96 0 top  (outside the outline)
ADC4  -165.1,-77.47 0 top  (outside the outline)
C1  80.01,48.26 270 top
C2  40.64,53.34 270 top
C3  48.26,53.34 270 top
C4  50.8,53.34 270 top
C5  59.69,45.72 90 top
C6  66.04,45.72 90 top
C7  71.12,45.72 90 top
C8  77.47,48.26 270 top
C9  82.55,58.42 180 top
C10  82.55,64.77 180 top
C11  82.55,69.85 0 top
C12  82.55,72.39 0 top
C13  69.85,77.47 270 top
C14  64.77,77.47 270 top
C15  57.15,76.2 180 top
C16  50.8,73.66 0 top
C17  50.8,71.12 0 top
C18  45.72,63.5 0 top
C19  45.72,57.15 180 top
C20  24.13,91.44 0 top
C21  31.75,24.13 0 top
C22  31.75,113.03 0 top
C23  -116.84,121.92 0 top  (outside the outline)
C24  -162.56,-49.53 0 top  (outside the outline)
C25  -162.56,-66.04 0 top  (outside the outline)
C26  -162.56,-82.55 0 top  (outside the outline)
C27  -17.78,121.92 0 top  (outside the outline)
C28  -16.51,127 0 top  (outside the outline)
C29  -21.59,127 0 top  (outside the outline)
C30  -26.67,127 0 top  (outside the outline)
C31  1.27,59.69 0 top
C32  1.27,53.34 0 top
C33  -93.98,116.84 0 top  (outside the outline)
C34  -160.02,-125.73 0 top  (outside the outline)
C35  -167.64,-125.73 0 top  (outside the outline)
C36  1.27,64.77 0 top
C37  -181.61,-172.72 0 top  (outside the outline)
C41  -62.23,121.92 0 top  (outside the outline)
C42  -101.6,116.84 0 top  (outside the outline)
C44  -68.58,121.92 0 top  (outside the outline)
C46  -74.93,121.92 0 top  (outside the outline)
C47  -109.22,116.84 0 top  (outside the outline)
D_5  -63.5,109.22 0 top  (outside the outline)
D_6  -69.85,109.22 0 top  (outside the outline)
DRIVERS  7.62,21.59 90 top
DUZY_PRAD  -43.18,6.35 0 top  (outside the outline)
DUZY_PRAD1  -140.97,-34.29 0 top  (outside the outline)
DUZY_PRAD2  -152.4,-34.29 0 top  (outside the outline)
DUZY_PRAD3  -163.83,-34.29 0 top  (outside the outline)
ENKODER1  -53.34,97.79 0 top  (outside the outline)
ENKODER2  -41.91,97.79 0 top  (outside the outline)
ENKODER3  -64.77,97.79 0 top  (outside the outline)
F1  13.97,92.71 0 top
F4  16.51,16.51 0 top
F5  15.24,105.41 0 top
GRZALKA1  -123.19,97.79 0 top  (outside the outline)
GRZALKA2  -90.17,97.79 0 top  (outside the outline)
GRZALKA3  -113.03,97.79 0 top  (outside the outline)
GRZALKA4  -101.6,97.79 0 top  (outside the outline)
HEATERS  6.35,109.22 90 top
I2C  -76.2,97.79 0 top  (outside the outline)
IC1  -109.22,66.04 0 top  (outside the outline)
IC2  -85.09,5.08 0 top  (outside the outline)
IC3  -121.92,66.04 0 top  (outside the outline)
IC4  -21.59,76.2 0 top  (outside the outline)
INDUKCYJNY  -99.06,104.14 0 top  (outside the outline)
JP1  68.58,82.55 180 top
KR1  -45.72,104.14 0 top  (outside the outline)
KR2  -54.61,104.14 0 top  (outside the outline)
KR3  -63.5,104.14 0 top  (outside the outline)
KR4  -72.39,104.14 0 top  (outside the outline)
KR5  -81.28,104.14 0 top  (outside the outline)
KR6  -90.17,104.14 0 top  (outside the outline)
KR7  -35.56,74.93 0 top  (outside the outline)
LASER  -36.83,104.14 0 top  (outside the outline)
LCD1  -105.41,30.48 0 top  (outside the outline)
LCD2  -24.13,43.18 0 top  (outside the outline)
LED1  -167.64,-93.98 0 top  (outside the outline)
LOGIC  6.35,93.98 90 top
M1  -92.71,90.17 0 top  (outside the outline)
M2  -104.14,90.17 0 top  (outside the outline)
M3  -115.57,90.17 0 top  (outside the outline)
M4  -30.48,97.79 0 top  (outside the outline)
M5  -19.05,97.79 0 top  (outside the outline)
M6  -127,90.17 0 top  (outside the outline)
Q2  -85.09,57.15 0 top  (outside the outline)
Q3  -115.57,57.15 0 top  (outside the outline)
R1  57.15,78.74 0 top
R2  43.18,53.34 90 top
R3  5.08,48.26 0 top
R4  7.62,76.2 0 top
R5  7.62,73.66 0 top
R6  7.62,71.12 0 top
R7  -96.52,121.92 0 top  (outside the outline)
R8  -167.64,-49.53 0 top  (outside the outline)
R9  -167.64,-54.61 0 top  (outside the outline)
R10  -167.64,-66.04 0 top  (outside the outline)
R11  -182.88,-130.81 0 top  (outside the outline)
R12  8.89,48.26 0 top
R13  -52.07,127 0 top  (outside the outline)
R14  50.8,113.03 0 top
R15  50.8,116.84 0 top
R17  -72.39,127 0 top  (outside the outline)
R18  -167.64,-71.12 0 top  (outside the outline)
R19  -167.64,-82.55 0 top  (outside the outline)
R20  -167.64,-87.63 0 top  (outside the outline)
R21  -92.71,127 0 top  (outside the outline)
R22  -97.79,127 0 top  (outside the outline)
R23  -102.87,127 0 top  (outside the outline)
R24  -107.95,127 0 top  (outside the outline)
R25  -113.03,127 0 top  (outside the outline)
R26  -118.11,127 0 top  (outside the outline)
R27  -123.19,127 0 top  (outside the outline)
R28  -182.88,-135.89 0 top  (outside the outline)
R29  -182.88,-140.97 0 top  (outside the outline)
R30  -16.51,132.08 0 top  (outside the outline)
R31  -21.59,132.08 0 top  (outside the outline)
R32  -26.67,132.08 0 top  (outside the outline)
R33  -31.75,132.08 0 top  (outside the outline)
R34  -36.83,132.08 0 top  (outside the outline)
R35  -182.88,-146.05 0 top  (outside the outline)
R36  -46.99,132.08 0 top  (outside the outline)
R37  -52.07,132.08 0 top  (outside the outline)
R38  -182.88,-156.21 0 top  (outside the outline)
R39  -62.23,132.08 0 top  (outside the outline)
R40  -67.31,132.08 0 top  (outside the outline)
R41  -72.39,132.08 0 top  (outside the outline)
R42  -182.88,-151.13 0 top  (outside the outline)
R43  -82.55,132.08 0 top  (outside the outline)
R44  -87.63,132.08 0 top  (outside the outline)
R45  -92.71,132.08 0 top  (outside the outline)
R46  -97.79,132.08 0 top  (outside the outline)
R47  -102.87,132.08 0 top  (outside the outline)
R48  -107.95,132.08 0 top  (outside the outline)
R49  -113.03,132.08 0 top  (outside the outline)
R50  -118.11,132.08 0 top  (outside the outline)
R51  -123.19,132.08 0 top  (outside the outline)
R52  -128.27,132.08 0 top  (outside the outline)
R53  -133.35,132.08 0 top  (outside the outline)
R54  -16.51,137.16 0 top  (outside the outline)
R55  -21.59,137.16 0 top  (outside the outline)
R56  -26.67,137.16 0 top  (outside the outline)
R57  -31.75,137.16 0 top  (outside the outline)
R58  -36.83,137.16 0 top  (outside the outline)
R59  -41.91,137.16 0 top  (outside the outline)
R60  -46.99,137.16 0 top  (outside the outline)
R61  -52.07,137.16 0 top  (outside the outline)
R62  -57.15,137.16 0 top  (outside the outline)
R63  -62.23,137.16 0 top  (outside the outline)
R64  -67.31,137.16 0 top  (outside the outline)
R65  -64.77,90.17 0 top  (outside the outline)
R66  -73.66,90.17 0 top  (outside the outline)
R67  -82.55,90.17 0 top  (outside the outline)
R68  -133.35,-2.54 0 top  (outside the outline)
R69  -72.39,137.16 0 top  (outside the outline)
R70  -77.47,137.16 0 top  (outside the outline)
R71  -82.55,137.16 0 top  (outside the outline)
R72  -87.63,137.16 0 top  (outside the outline)
R73  -92.71,137.16 0 top  (outside the outline)
R74  -97.79,137.16 0 top  (outside the outline)
R75  -102.87,137.16 0 top  (outside the outline)
R76  -107.95,137.16 0 top  (outside the outline)
R77  -113.03,137.16 0 top  (outside the outline)
R78  -118.11,137.16 0 top  (outside the outline)
R79  -123.19,137.16 0 top  (outside the outline)
R80  -128.27,137.16 0 top  (outside the outline)
R82  -16.51,142.24 0 top  (outside the outline)
R83  -21.59,142.24 0 top  (outside the outline)
R84  -26.67,142.24 0 top  (outside the outline)
R85  -133.35,-7.62 0 top  (outside the outline)
R86  -133.35,-12.7 0 top  (outside the outline)
R87  -133.35,-17.78 0 top  (outside the outline)
R88  -133.35,-22.86 0 top  (outside the outline)
R89  -133.35,-27.94 0 top  (outside the outline)
R90  -133.35,-33.02 0 top  (outside the outline)
R91  -133.35,-38.1 0 top  (outside the outline)
R92  -167.64,-97.79 0 top  (outside the outline)
RS-485  -22.86,110.49 0 top  (outside the outline)
S1  34.29,52.07 180 top
SHOTKY1  12.7,54.61 270 top
TRANSIL_1  34.29,85.09 0 top
TRANSIL_2  20.32,24.13 0 top
TRANSIL_3  21.59,113.03 0 top
U$1  67.31,62.23 270 top
U$2  45.72,53.34 90 top
U$3  17.78,81.28 0 top
U$4  10.16,82.55 0 top
U$5  7.62,59.69 270 top
U$6  -179.07,-165.1 0 top  (outside the outline)
U$20  -58.42,140.97 0 top  (outside the outline)
U$21  -60.96,140.97 0 top  (outside the outline)
U$22  -63.5,140.97 0 top  (outside the outline)
U$23  -66.04,140.97 0 top  (outside the outline)
U$24  -68.58,140.97 0 top  (outside the outline)
U$25  -71.12,140.97 0 top  (outside the outline)
V-ENK  -166.37,-119.38 0 top  (outside the outline)
V-RS  -106.68,76.2 0 top  (outside the outline)
WEN1  -59.69,74.93 0 top  (outside the outline)
WEN2  -68.58,74.93 0 top  (outside the outline)
WIFI  -49.53,74.93 0 top  (outside the outline)
X1  64.77,114.3 0 top
XTAL1  45.72,60.96 0 top

### Tracks (layer width: path | path; a pad name or v marks a point on that pad's centre or on a via)
+3V3  (46 unrouted)
  Top 0.406: C7.2 71.12,51.57 U$1.62 | C6.2 66.04,51.61 U$1.52 | C5.2 59.69,51.5 U$1.39 | U$2.1 R2.1 43.18,52.07 44.45,50.8 | U$1.6 53.44,68.48 51.65,70.27 C17.2 C16.2 | C15.1 58,73.39 U$1.144 | U$1.131 65.06,76.33 C14.2 | U$1.121 70.06,76.41 C13.2 | U$1.95 81.41,64.48 C10.2 | U$1.84 81.14,58.98 C9.2 | U$1.72 76.64,51.63 79.16,49.11 C1.1
+12V  (22 unrouted)
+24V  (27 unrouted)
ADC3_POMIAR_NAPIECIA  (3 unrouted)
ADC_PRAD_X  (3 unrouted)
ADC_PRAD_Y  (3 unrouted)
ADC_PRAD_Z  (3 unrouted)
ADC_TER_BED  (8 unrouted)
ENDSTOP1  (1 unrouted)
ENDSTOP2  (1 unrouted)
ENDSTOP3  (1 unrouted)
ENDSTOP_E1  (1 unrouted)
ENDSTOP_E2  (1 unrouted)
ENDSTOP_E3  (1 unrouted)
ENDSTOP_X_MAX  (1 unrouted)
ENDSTOP_X_MINI  (1 unrouted)
ENDSTOP_Y_MAX  (1 unrouted)
ENDSTOP_Y_MINI  (1 unrouted)
ENDSTOP_Z_MAX  (1 unrouted)
ENDSTOP_Z_MINI  (1 unrouted)
GND  (124 unrouted)
  Top 0.406: U$1.107 79.37,70.48 81.28,72.39 C12.1
  pour Top: 0,128.27 167.64,128.27 167.64,2.54 0,2.54
GPIO_WEN  (1 unrouted)
GRZALKA1  (1 unrouted)
GRZALKA2  (1 unrouted)
GRZALKA3  (1 unrouted)
GRZALKA4  (1 unrouted)
HALF_REF  (4 unrouted)
I2C1_SCL  (2 unrouted)
I2C1_SDA  (2 unrouted)
LCD4  (1 unrouted)
LCD5  (1 unrouted)
LCD6  (1 unrouted)
LCD7  (1 unrouted)
LCD_BEEPER  (1 unrouted)
LCD_EN  (1 unrouted)
LCD_ENK_SWITCH  (1 unrouted)
LCD_ENKODER1  (1 unrouted)
LCD_ENKODER2  (1 unrouted)
LCD_RESET  (1 unrouted)
LCD_SPI2_CLK  (1 unrouted)
LCD_SPI2_CS  (1 unrouted)
LCD_SPI2_MISO  (1 unrouted)
LCD_SPI2_MOSI  (1 unrouted)
MLOG_1  (1 unrouted)
MLOG_2  (1 unrouted)
MLOG_3  (1 unrouted)
MLOG_4  (1 unrouted)
MLOG_5  (1 unrouted)
MLOG_6  (1 unrouted)
N$1  (3 unrouted)
N$2
  Top 0.406: U$1.71 75.56,50.17 76.62,49.11 C8.1
N$3  (2 unrouted)
N$4  (1 unrouted)
N$5  (1 unrouted)
  Top 0.406: U$2.2 C3.1 C4.1 51.59,54.98 54.61,54.98 | U$1.33 54.61,54.98 | U$1.32 55.11,55.48 54.61,54.98
N$6  (2 unrouted)
N$7  (1 unrouted)
N$8  (1 unrouted)
N$9  (2 unrouted)
N$10  (1 unrouted)
N$11  (5 unrouted)
N$12  (1 unrouted)
N$13  (1 unrouted)
N$15  (5 unrouted)
N$16  (1 unrouted)
N$17  (1 unrouted)
N$18  (1 unrouted)
N$19
  Top 0.406: U$1.106 81.57,69.98 C11.1
N$20  (1 unrouted)
N$21  (1 unrouted)
N$22  (1 unrouted)
N$23  (1 unrouted)
N$24  (1 unrouted)
N$25  (1 unrouted)
N$26
  Top 0.406: U$1.138 61.56,76.87 59.69,78.74 R1.2
N$27  (1 unrouted)
N$28  (1 unrouted)
N$29  (1 unrouted)
N$30  (2 unrouted)
N$31  (2 unrouted)
N$32  (1 unrouted)
N$33  (1 unrouted)
N$34  (1 unrouted)
N$35  (1 unrouted)
N$36  (1 unrouted)
N$37  (1 unrouted)
N$38  (1 unrouted)
N$39  (1 unrouted)
N$40  (2 unrouted)
N$41  (1 unrouted)
N$42  (2 unrouted)
N$43  (2 unrouted)
N$44  (2 unrouted)
N$45  (1 unrouted)
N$46  (1 unrouted)
N$47  (2 unrouted)
N$48  (1 unrouted)
N$49  (1 unrouted)
N$50  (1 unrouted)
N$51  (1 unrouted)
N$52  (1 unrouted)
N$53  (1 unrouted)
N$54  (1 unrouted)
N$55  (1 unrouted)
N$56  (1 unrouted)
N$57  (1 unrouted)
N$58  (1 unrouted)
N$59  (1 unrouted)
N$60  (1 unrouted)
N$61  (1 unrouted)
N$62  (1 unrouted)
N$63  (1 unrouted)
N$64  (1 unrouted)
N$65  (1 unrouted)
N$67  (1 unrouted)
N$68  (1 unrouted)
N$69  (1 unrouted)
N$70  (1 unrouted)
N$71  (1 unrouted)
N$72  (1 unrouted)
N$73  (2 unrouted)
N$74  (3 unrouted)
N$75  (3 unrouted)
N$76  (3 unrouted)
N$77  (5 unrouted)
N$78  (5 unrouted)
N$79  (2 unrouted)
N$80  (3 unrouted)
N$81  (2 unrouted)
N$83  (5 unrouted)
N$84  (1 unrouted)
N$85  (1 unrouted)
N$86  (1 unrouted)
N$87  (1 unrouted)
N$88  (1 unrouted)
N$89  (6 unrouted)
N$90  (1 unrouted)
N$91  (1 unrouted)
N$92  (1 unrouted)
N$93  (1 unrouted)
N$94  (1 unrouted)
N$95  (1 unrouted)
N$96  (2 unrouted)
N$97  (1 unrouted)
N$99  (4 unrouted)
NRST  (via drill 0.6)
  Top 0.406: S1.4 S1.3 37.67,54.19 C2.1 R2.2 37.25,54.19 v36.83,54.61 | v59.69,58.42 57.27,58.42 U$1.25
  Bottom 0.406: JP1.4 64.77,63.5 v59.69,58.42 55.88,54.61 v36.83,54.61
PWM_SOFT_LASER  (1 unrouted)
RCC_IN
  Top 0.406: U$1.23 50.51,59.98 46.99,63.5 C18.2 46.57,62.06 XTAL1.3
RCC_OUT
  Top 0.406: U$1.24 49.32,59.48 48.26,58.42 45.72,58.42 45.09,57.78 | XTAL1.1 44.45,59.94 44.45,58.42 45.09,57.78 | C19.2 44.87,57.57 45.09,57.78
RS485_UART2_RTS  (2 unrouted)
RS485_UART2_TX  (4 unrouted)
SWCLK
  Top 0.406: U$1.109 76.06,81.42 74.93,82.55 JP1.1
SWDIO  (via drill 0.6)
  Top 0.406: v80.01,68.58 79.11,69.48 U$1.105
  Bottom 0.406: JP1.3 71.12,82.55 80.01,73.66 v80.01,68.58
TIM1_ENKODER1  (1 unrouted)
TIM1_ENKODER2  (1 unrouted)
TIM2_ENKODER1  (1 unrouted)
TIM2_ENKODER2  (1 unrouted)
TIM3_ENKODER1  (1 unrouted)
TIM3_ENKODER2  (1 unrouted)
TIM4_PWM_WEN  (1 unrouted)
TIM4_PWM_X1  (1 unrouted)
TIM4_PWM_X2  (1 unrouted)
TIM4_PWM_X3  (1 unrouted)
TIM5_PWM_Y1  (1 unrouted)
TIM5_PWM_Y2  (1 unrouted)
TIM5_PWM_Y3  (1 unrouted)
TIM8_EX3_2  (1 unrouted)
TIM8_PWM_Z1  (3 unrouted)
TIM8_PWM_Z2  (1 unrouted)
TIM8_PWM_Z3  (1 unrouted)
TIM9_EX1_1  (1 unrouted)
TIM9_EX1_2  (1 unrouted)
TIM12_EX2_1  (1 unrouted)
TIM12_EX2_2  (1 unrouted)
UART4_WIFI_RX  (1 unrouted)
UART4_WIFI_TX  (1 unrouted)
USB_DM  (1 unrouted)
USB_DP  (1 unrouted)
VDD  (6 unrouted)
W1_1  (1 unrouted)
W1_2  (1 unrouted)
W2_1  (1 unrouted)
W2_2  (1 unrouted)
W3_1  (1 unrouted)
W3_2  (1 unrouted)